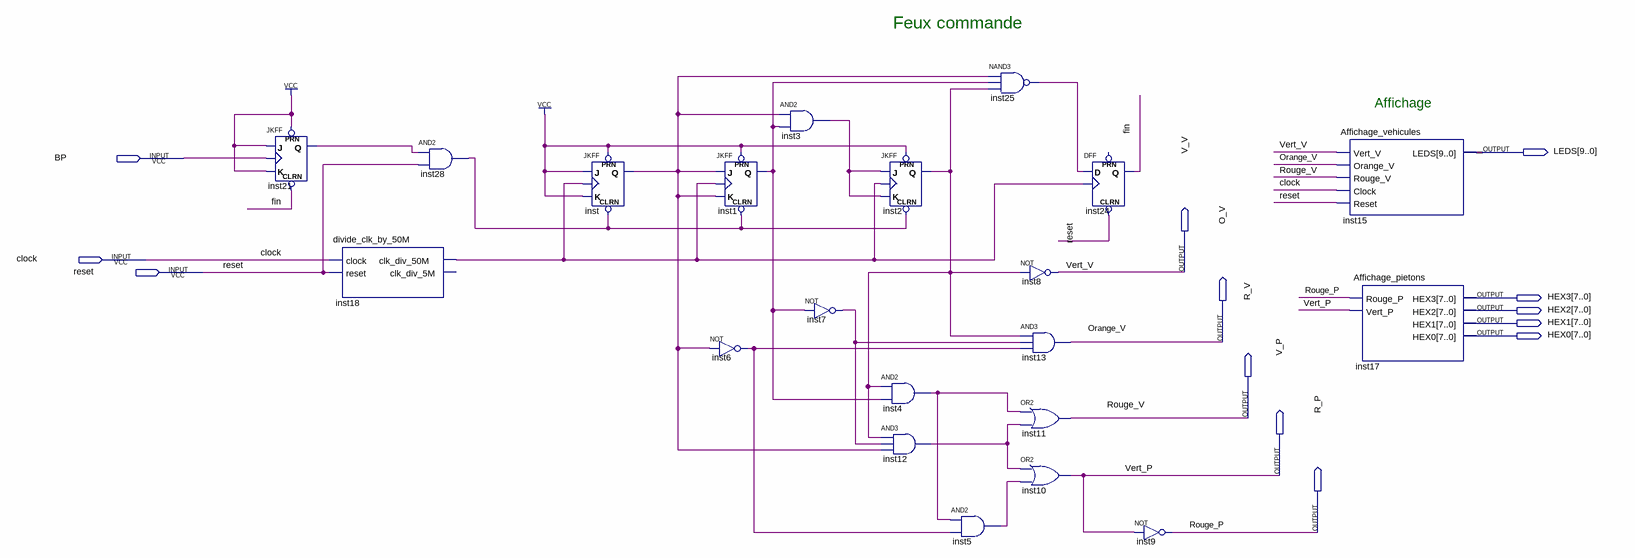
[diagram p0: schematic sheet]
// Quartus schematic 3_Feux_commande.bdf as structural Verilog: 21 symbols, 13 pins
module \3_Feux_commande  (
  input  BP,
  input  clock,
  input  reset,
  output [9:0] LEDS,
  output V_V,
  output [7:0] HEX3,
  output [7:0] HEX2,
  output [7:0] HEX1,
  output [7:0] HEX0,
  output O_V,
  output R_V,
  output V_P,
  output R_P
);

  wire fin, inst1_q, inst2_q, inst3_out, inst4_out, inst5_out, inst6_out, inst7_out, inst12_out,
       inst18_clk_div_50m, inst21_q, inst25_out, inst28_out, inst_q;

  JKFF inst21 (.PRN(1'b1), .CLRN(fin), .K(1'b1), .J(1'b1), .CLK(BP), .Q(inst21_q));
  divide_clk_by_50M inst18 (.clock(clock), .reset(reset), .clk_div_50M(inst18_clk_div_50m));  // open: clk_div_5M
  and inst28 (inst28_out, inst21_q, reset);
  JKFF inst (.PRN(1'b1), .CLRN(inst28_out), .K(1'b1), .J(1'b1), .CLK(inst18_clk_div_50m), .Q(inst_q));
  JKFF inst1 (.PRN(1'b1), .CLRN(inst28_out), .K(inst_q), .J(inst_q), .CLK(inst18_clk_div_50m), .Q(inst1_q));
  not inst6 (inst6_out, inst_q);
  and inst3 (inst3_out, inst_q, inst1_q);
  not inst7 (inst7_out, inst1_q);
  JKFF inst2 (.PRN(1'b1), .CLRN(inst28_out), .K(inst3_out), .J(inst3_out), .CLK(inst18_clk_div_50m), .Q(inst2_q));
  and inst4 (inst4_out, inst2_q, inst1_q);
  and inst12 (inst12_out, inst2_q, inst7_out, inst_q);
  and inst5 (inst5_out, inst4_out, inst6_out);
  nand inst25 (inst25_out, inst_q, inst1_q, inst2_q);
  not inst8 (V_V, inst2_q);
  and inst13 (O_V, inst2_q, inst7_out, inst6_out);
  or inst11 (R_V, inst4_out, inst12_out);
  or inst10 (V_P, inst12_out, inst5_out);
  DFF inst24 (.CLRN(reset), .CLK(inst18_clk_div_50m), .D(inst25_out), .Q(fin));  // open: PRN
  not inst9 (R_P, V_P);
  Affichage_vehicules inst15 (.Vert_V(V_V), .Orange_V(O_V), .Rouge_V(R_V), .Clock(clock), .Reset(reset), .LEDS(LEDS));
  Affichage_pietons inst17 (.Rouge_P(R_P), .Vert_P(V_P), .HEX3(HEX3), .HEX2(HEX2), .HEX1(HEX1), .HEX0(HEX0));

  // Other names for the same wires on the sheet: Orange_V = O_V; Rouge_P = R_P; Rouge_V = R_V; Vert_P = V_P;
  //   Vert_V = V_V

  // Notes on the sheet:
  //   Feux commande     
  //   Affichage   
endmodule
